# Altium schematic sheet Cree_Testing_Board.SchDoc
size Letter; SheetNumber: 1; SheetTotal: 1
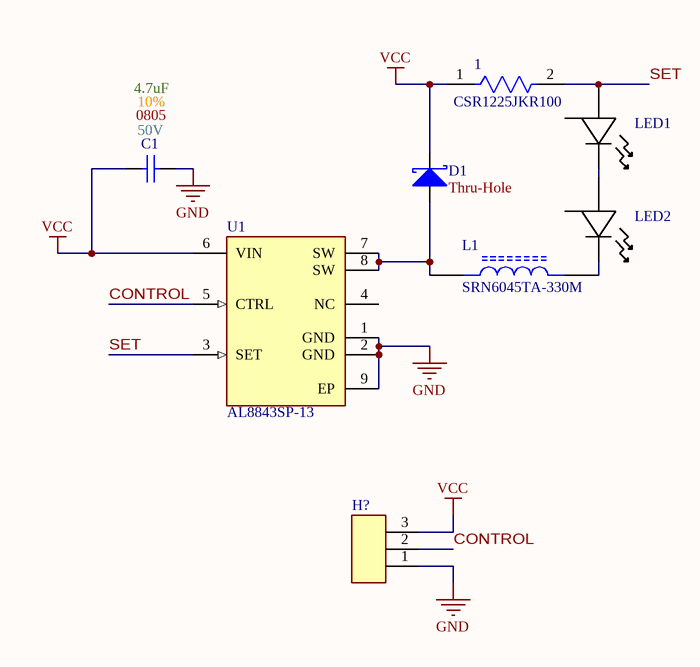
[diagram p0: Cree_Testing_Board.SchDoc]

## Parts
1  CSR1225JKR100  [FP-CSR1225-IPC_B]
C1  Max Voltage: 50V  Size Package: 0805  Tolerance: 10%  Capacitance: 4.7uF  [[Cap] SMD 0805]  (hidden comment: [Cap] 0805 4.7uF 10% 50V)
D1  Footprint: Thru-Hole  [[Diode] Thru-Hole]  (hidden comment: 1N5822)
H?  [Header] 1x3 90deg Male  [[Header] 1x3 90deg Male]  (value not drawn)
L1  SRN6045TA-330M  [IND_SRN6045TA-330M]
LED1  XPGWHT-01-0000-00DC4  [LED_CREE_XPG]  (value not drawn)
LED2  XPGWHT-01-0000-00DC4  [LED_CREE_XPG]  (value not drawn)
U1  AL8843SP-13  [FP-SO-8EP-MFG]

## Nets
GND: C1.2 H?.1 U1.1(GND) U1.2(GND) U1.9(EP)
VCC: 1.1 C1.1 D1.1(K) H?.3 U1.6(VIN)
CONTROL: H?.2 U1.5(CTRL)
SET: 1.2 LED1.3(ANODE) U1.3(SET)
NetD1_2: D1.2(A) L1.1 U1.7(SW) U1.8(SW)
NetL1_2: L1.2 LED2.1(CATHODE)
NetLED1_1: LED1.1(CATHODE) LED2.3(ANODE)

Not connected (* = marked no-connect by the designer): LED1 2(HEAT_TAB); LED2 2(HEAT_TAB); U1 4(NC)

## Library data of the parts
1 = CMP-26527-003070-1: General Purpose Thick Film Chip Resistor, 1225, 0.1Ω, 5%, 100ppm/°C, 3W; Resistance: 100mR; Resistor Type: Thick Film; Min Operating Temperature: -55°C; RoHS Compliant: Yes; Length: 0.122inch; Package Quantity: 1000; Max Power Dissipation: 3W; Width: 0.248inch; Number of Terminations: 2; Tolerance: 5%; Temperature Coefficient: 100ppm/°C; Mount: Surface Mount; Height: 0.041inch; Packaging: Tape and Reel; Max Operating Temperature: 155°C; Series: CSR; Case Code (Metric): 6432; Case/Package: 1225; Case Code (Imperial): 2512
C1 = [Cap] 0805 4.7uF 10% 50V: GRT21BR61H475KE13L; Supplier 1: DigiKey; Supplier Part Number 1: 490-12394-1-ND
D1 = [Schottky] Thru-Hole 40V 3A: Supplier 1: DigiKey; Supplier Part Number 1: 1N5822GOS-ND
H? = [Header] 1x3 90deg Male: 2.54mm pitch
L1 = SRN6045TA-330M: Inductors, Fixed, 33uH 20% 1.5A shd SMD AEC-Q200 | Bourns SRN6045TA-330M; SnapEDA_Link: https://www.snapeda.com/parts/SRN6045TA-330M/Bourns/view-part/?ref=snap; Package: Nonstandard Bourns; Value: *; MF: Bourns; MP: SRN6045TA-330M; Check_prices: https://www.snapeda.com/parts/SRN6045TA-330M/Bourns/view-part/?ref=eda
LED1 LED2 = XPGWHT-01-0000-00DC4: No Description Available; Manufacturer_Name: Cree LED; VALUE_2: Value; Copyright: Copyright (C) 2026 Ultra Librarian. All rights reserved.; Manufacturer_Part_Number: XPGWHT-01-0000-00DC4
U1 = CMP-12753-000007-1: IC LED MV INT SWITCH SO-8EP; Manufacturer: Diodes Inc.; Output Voltage: 36V; Switching Frequency: 1MHz; Max Supply Voltage: 40V; Output Current: 3A; Dimming: Analog,PWM; Standoff Height: 0mm; Number Of Outputs: 1; Min Supply Voltage: 4.5V; Max Junction Temp: +125°C; Nominal Supply Current: 0.35mA; Switching Topology: Buck; ComponentLink2URL: https://www.diodes.com/assets/Datasheets/AL8843.pdf; Temperature: -40°C to +125°C; Device Class L1: Integrated Circuits (ICs); RoHS: TRUE; Device Class L2: Power Management ICs; Automotive: No; Octopart: https://octopart.com/al8843sp-13-diodes+inc.-88289989; Ambient Temperature Range High: +105°C; Digikey Description: IC LED MV INT SWITCH SO-8EP; Manufacturer Part Number: AL8843SP-13; Height: 1.63mm; Ipc Land Pattern Name: SOP127P600X163-8; Package: SO-8EP; ComponentLink2Description: Datasheet; Lead Free: Yes; Footprint Url: https://www.diodes.com/assets/Package-Files/SO-8EP.pdf; Category: IC; Temperature Range High: +125°C; Device Class L3: LED Drivers; Ambient Temperature Range Low: -40°C; Temperature Range Low: -40°C